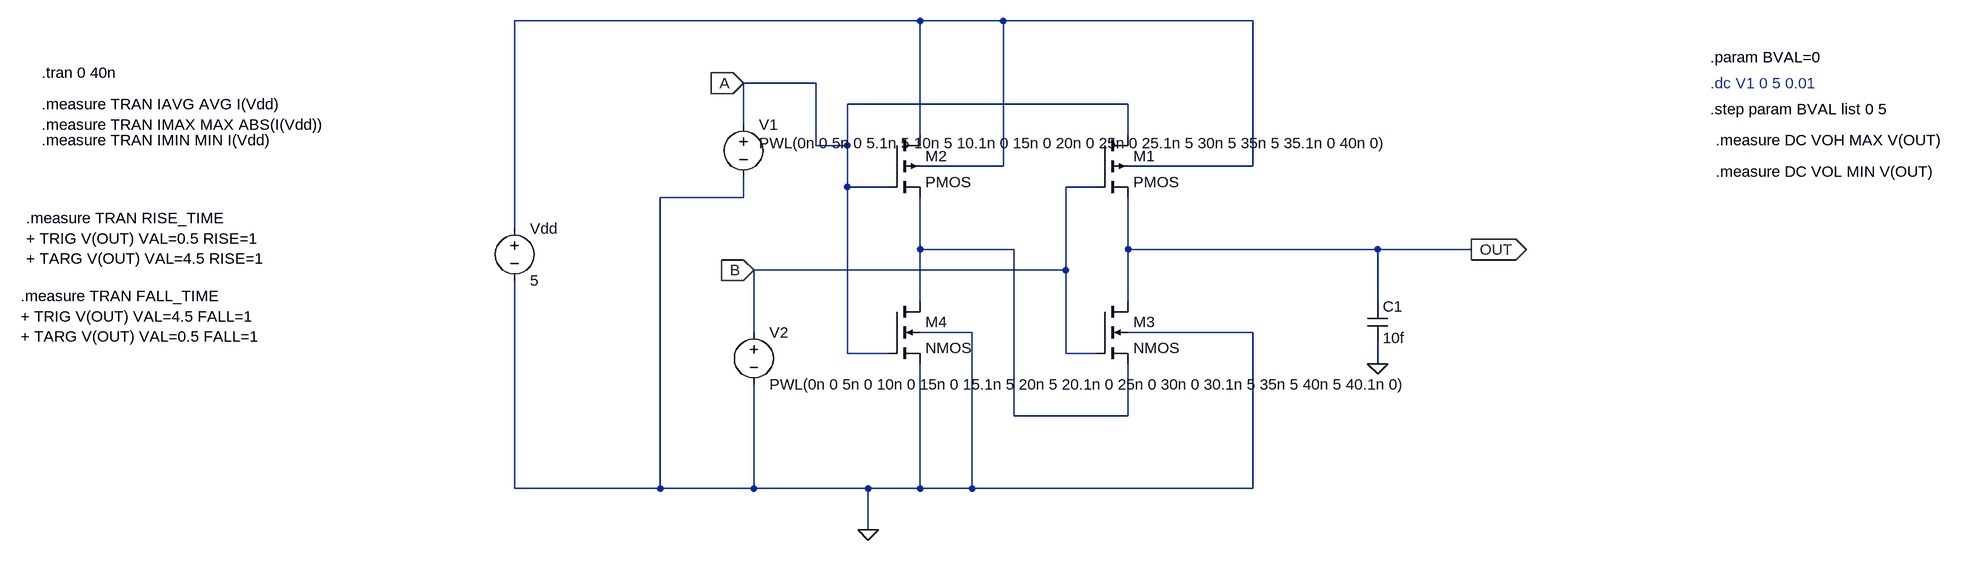
[diagram p0: schematic cmos_xor.asc]
cmos_xor.asc, the LTspice schematic file:
Version 4.1
SHEET 1 1780 680
WIRE 112 -160 -512 -160
WIRE 240 -160 112 -160
WIRE 624 -160 240 -160
WIRE -48 -64 -160 -64
WIRE 432 -32 0 -32
WIRE -160 0 -160 -64
WIRE 112 16 112 -160
WIRE 432 16 432 -32
WIRE -48 32 -48 -64
WIRE 0 32 0 -32
WIRE 0 32 -48 32
WIRE 240 64 240 -160
WIRE 240 64 112 64
WIRE 624 64 624 -160
WIRE 624 64 432 64
WIRE 0 96 0 32
WIRE 64 96 0 96
WIRE 384 96 336 96
WIRE -160 112 -160 80
WIRE -160 112 -288 112
WIRE -512 160 -512 -160
WIRE 112 192 112 112
WIRE 256 192 112 192
WIRE 432 192 432 112
WIRE 816 192 432 192
WIRE 960 192 816 192
WIRE 336 224 336 96
WIRE 336 224 -144 224
WIRE 112 272 112 192
WIRE 432 272 432 192
WIRE 816 272 816 192
WIRE -144 320 -144 224
WIRE 192 320 112 320
WIRE 624 320 432 320
WIRE 0 352 0 96
WIRE 64 352 0 352
WIRE 336 352 336 224
WIRE 384 352 336 352
WIRE 816 368 816 336
WIRE 256 448 256 192
WIRE 432 448 432 368
WIRE 432 448 256 448
WIRE -512 560 -512 240
WIRE -288 560 -288 112
WIRE -288 560 -512 560
WIRE -144 560 -144 400
WIRE -144 560 -288 560
WIRE 32 560 -144 560
WIRE 112 560 112 368
WIRE 112 560 32 560
WIRE 192 560 192 320
WIRE 192 560 112 560
WIRE 624 560 624 320
WIRE 624 560 192 560
WIRE 32 624 32 560
FLAG 32 624 0
FLAG 960 192 OUT
IOPIN 960 192 Out
FLAG -160 -64 A
IOPIN -160 -64 In
FLAG -144 224 B
IOPIN -144 224 In
FLAG 816 368 0
SYMBOL pmos4 384 16 R0
SYMATTR InstName M1
SYMBOL pmos4 64 16 R0
SYMATTR InstName M2
SYMBOL nmos4 384 272 R0
SYMATTR InstName M3
SYMBOL nmos4 64 272 R0
SYMATTR InstName M4
SYMBOL voltage -160 -16 R0
WINDOW 3 24 44 Left 2
WINDOW 123 0 0 Left 0
WINDOW 39 0 0 Left 0
SYMATTR Value PWL(0n 0 5n 0 5.1n 5 10n 5 10.1n 0 15n 0 20n 0 25n 0 25.1n 5 30n 5 35n 5 35.1n 0 40n 0)
SYMATTR InstName V1
SYMBOL voltage -144 304 R0
WINDOW 123 0 0 Left 0
WINDOW 39 0 0 Left 0
SYMATTR InstName V2
SYMATTR Value PWL(0n 0 5n 0 10n 0 15n 0 15.1n 5 20n 5 20.1n 0 25n 0 30n 0 30.1n 5 35n 5 40n 5 40.1n 0)
SYMBOL voltage -512 144 R0
SYMATTR InstName Vdd
SYMATTR Value 5
SYMBOL cap 800 272 R0
SYMATTR InstName C1
SYMATTR Value 10f
TEXT -1240 -80 Left 2 !.tran 0 40n
TEXT -1240 -32 Left 2 !.measure TRAN IAVG AVG I(Vdd)
TEXT -1240 0 Left 2 !.measure TRAN IMAX MAX ABS(I(Vdd))
TEXT -1240 24 Left 2 !.measure TRAN IMIN MIN I(Vdd)
TEXT -1264 144 Left 2 !.measure TRAN RISE_TIME\n+ TRIG V(OUT) VAL=0.5 RISE=1\n+ TARG V(OUT) VAL=4.5 RISE=1
TEXT -1272 264 Left 2 !.measure TRAN FALL_TIME\n+ TRIG V(OUT) VAL=4.5 FALL=1\n+ TARG V(OUT) VAL=0.5 FALL=1
TEXT 1328 -104 Left 2 !.param BVAL=0
TEXT 1328 -64 Left 2 ;.dc V1 0 5 0.01
TEXT 1328 -24 Left 2 !.step param BVAL list 0 5
TEXT 1336 24 Left 2 !.measure DC VOH MAX V(OUT)
TEXT 1336 72 Left 2 !.measure DC VOL MIN V(OUT)

The netlist it stands for:
* cmos_xor.asc
M1 A B OUT N001 PMOS
M2 N001 A N002 N001 PMOS
M3 OUT B N002 0 NMOS
M4 N002 A 0 0 NMOS
V1 A 0 PWL(0n 0 5n 0 5.1n 5 10n 5 10.1n 0 15n 0 20n 0 25n 0 25.1n 5 30n 5 35n 5 35.1n 0 40n 0)
V2 B 0 PWL(0n 0 5n 0 10n 0 15n 0 15.1n 5 20n 5 20.1n 0 25n 0 30n 0 30.1n 5 35n 5 40n 5 40.1n 0)
Vdd N001 0 5
C1 OUT 0 10f
.model NMOS NMOS
.model PMOS PMOS
.lib standard.mos
.tran 0 40n
.measure TRAN IAVG AVG I(Vdd)
.measure TRAN IMAX MAX ABS(I(Vdd))
.measure TRAN IMIN MIN I(Vdd)
.measure TRAN RISE_TIME
+ TRIG V(OUT) VAL=0.5 RISE=1
+ TARG V(OUT) VAL=4.5 RISE=1
.measure TRAN FALL_TIME
+ TRIG V(OUT) VAL=4.5 FALL=1
+ TARG V(OUT) VAL=0.5 FALL=1
.param BVAL=0
* .dc V1 0 5 0.01
.step param BVAL list 0 5
.measure DC VOH MAX V(OUT)
.measure DC VOL MIN V(OUT)
.backanno
.end